# EAGLE design openmv (EAGLE 6.1)
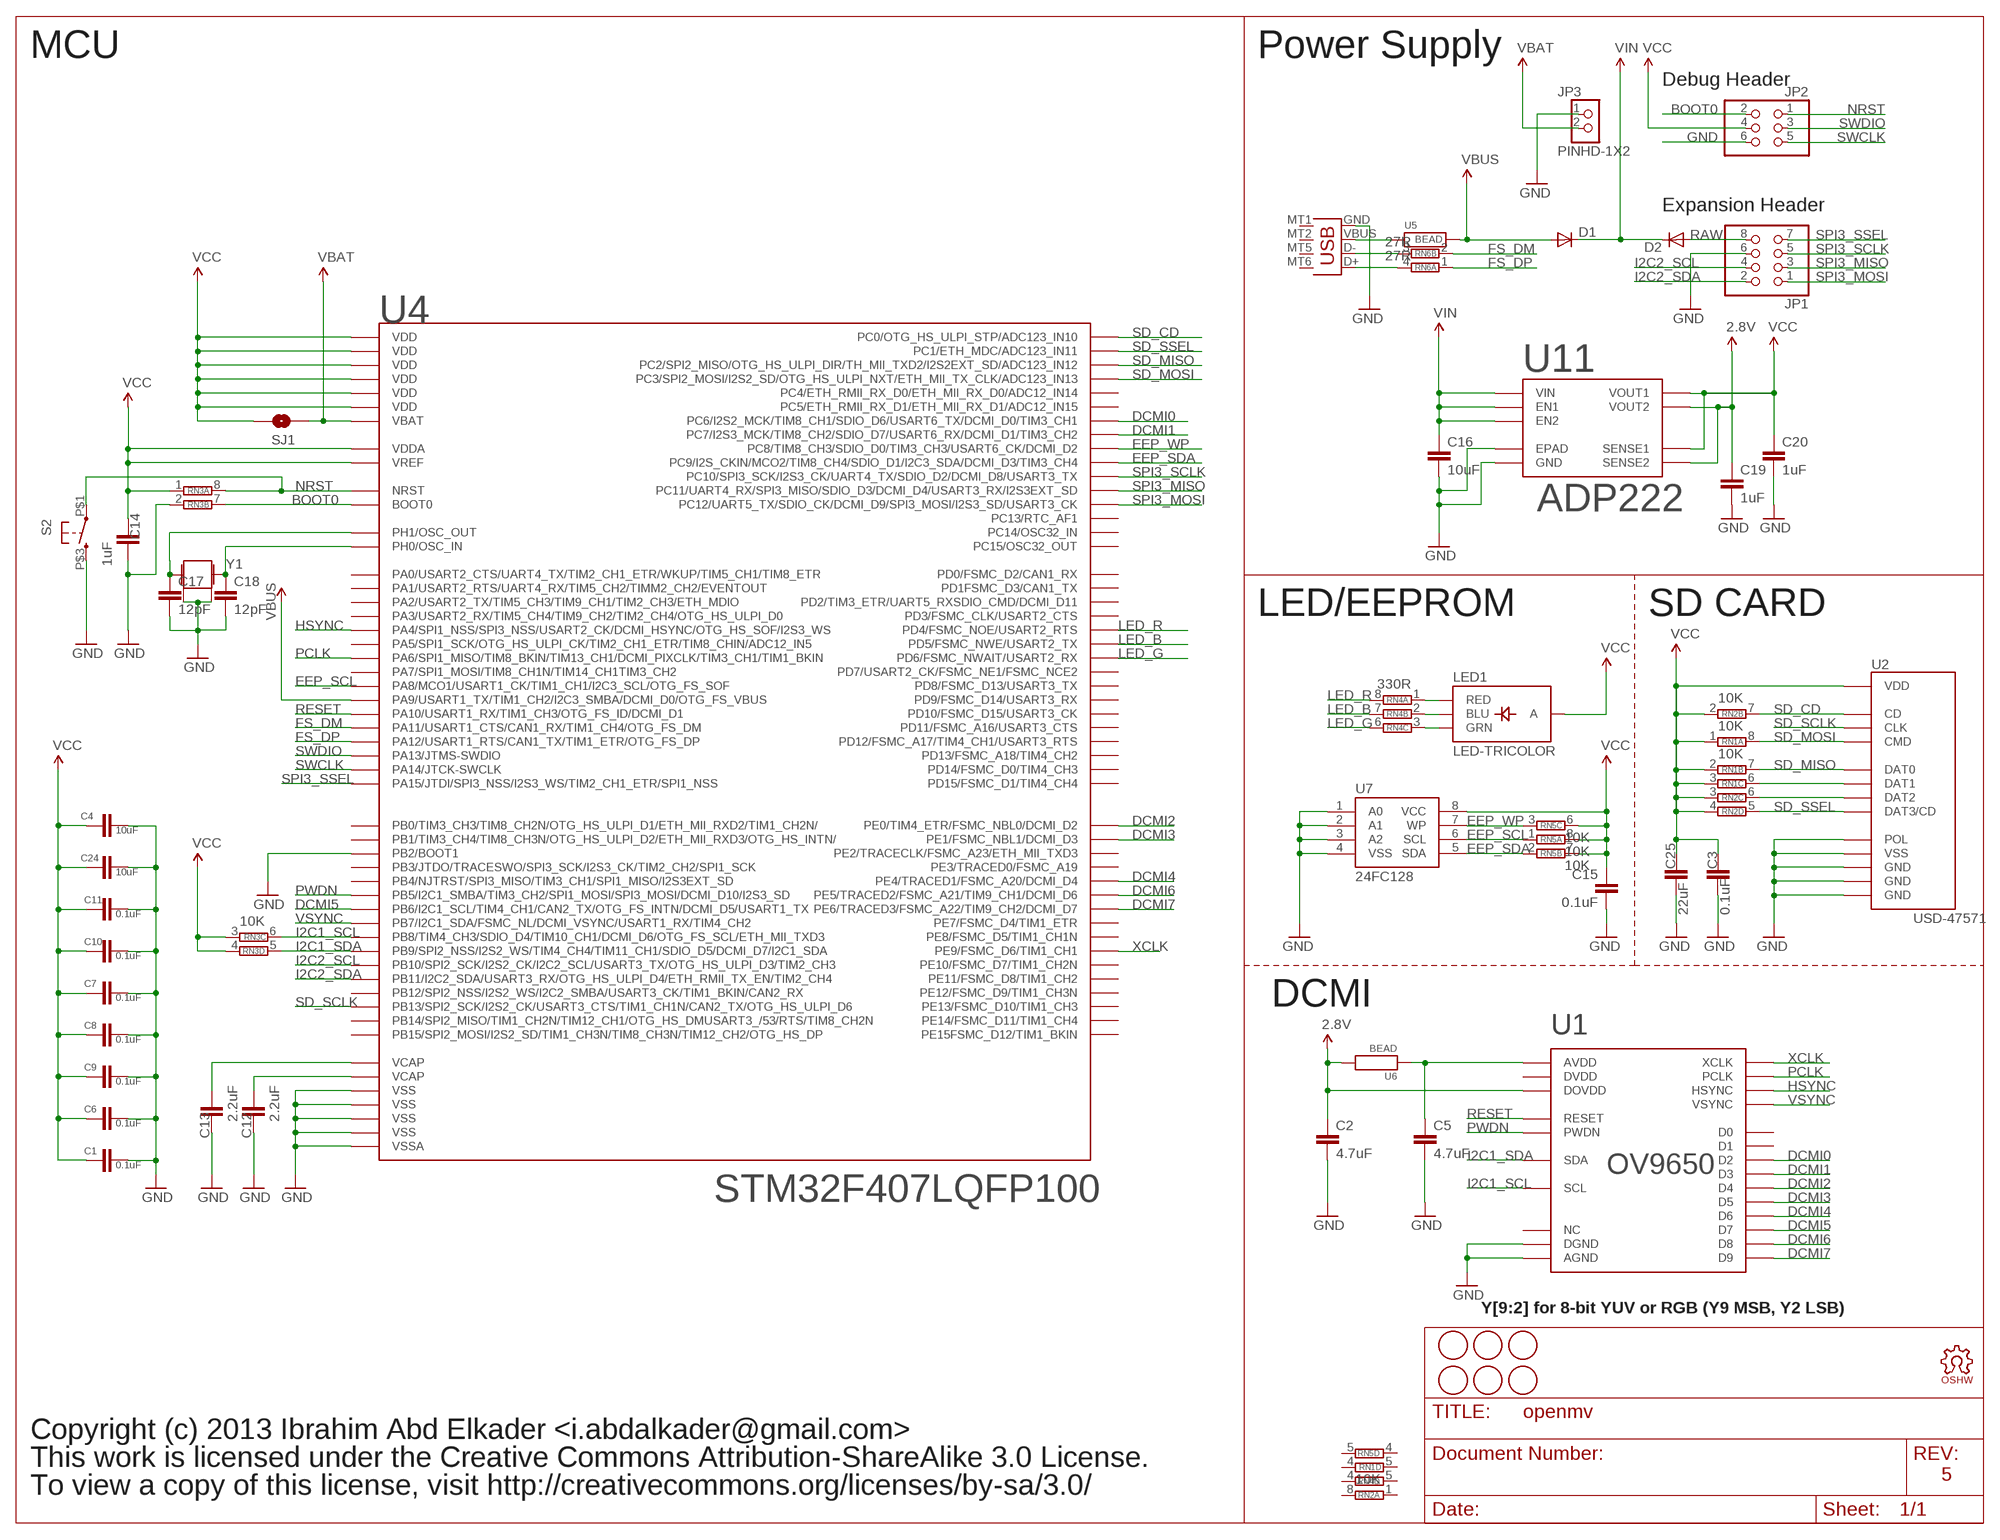
[diagram p0: schematic, sheet 1]

## Parts
C1  0.1uF  CAP0402-CAP  [0402-CAP]
C2  4.7uF  CAP0402-CAP  [0402-CAP]
C3  0.1uF  CAP0402-CAP  [0402-CAP]
C4  10uF  CAP0805  [0805]
C5  4.7uF  CAP0402-CAP  [0402-CAP]
C6  0.1uF  CAP0402-CAP  [0402-CAP]
C7  0.1uF  CAP0402-CAP  [0402-CAP]
C8  0.1uF  CAP0402-CAP  [0402-CAP]
C9  0.1uF  CAP0402-CAP  [0402-CAP]
C10  0.1uF  CAP0402-CAP  [0402-CAP]
C11  0.1uF  CAP0402-CAP  [0402-CAP]
C12  2.2uF  CAP0402-CAP  [0402-CAP]
C13  2.2uF  CAP0402-CAP  [0402-CAP]
C14  1uF  CAP0402-CAP  [0402-CAP]
C15  0.1uF  CAP0402-CAP  [0402-CAP]
C16  10uF  CAP0805  [0805]
C17  12pF  CAP0402-CAP  [0402-CAP]
C18  12pF  CAP0402-CAP  [0402-CAP]
C19  1uF  CAP0402-CAP  [0402-CAP]
C20  1uF  CAP0402-CAP  [0402-CAP]
C24  10uF  CAP0805  [0805]
C25  22uF  CAP0805  [0805]
D1  DIODESOD  [SOD-323]
D2  DIODESOD  [SOD-323]
JP1  PINHD-2X4  [2X04]
JP2  PINHD-2X3  [2X03]
JP3  PINHD-1X2  [1X2]
LED1  LED-TRICOLOR  [LED-TRICOLOR-SMD]
LOGO1  OSHW_LOGO_FILLX0150-NT  [OSHW_FILLX150_NOTEXT]
RN1  10K  4R-NCAT16  [CAT16]
RN2  10K  4R-NCAT16  [CAT16]
RN3  10K  4R-NCAT16  [CAT16]
RN4  330R  4R-NCAT16  [CAT16]
RN5  10K  4R-NCAT16  [CAT16]
RN6  27R  2R-NEXBV4V  [EXBV4V]
S2  SWITCHKMR442G  [KMR442G]
SJ1  SOLDERJUMPERTRACE  [SJ_2S-TRACE]
U1  OV9650  [OV9650]
U2  USD-47571  [USD-47571]
U4  STM32F407LQFP100  [LQFP100]
U5  BEAD  [0402-CAP]
U6  BEAD  [0402-CAP]
U7  24FC128  [MSOP8]
U11  ADP222  [LFCSP8]
U$3  FIDUCIAL  [FIDUCIAL_1MM]
U$4  FIDUCIAL  [FIDUCIAL_1MM]
U$5  FIDUCIAL  [FIDUCIAL_1MM]
U$7  FIDUCIAL  [FIDUCIAL_1MM]
U$9  FIDUCIAL  [FIDUCIAL_1MM]
U$10  FIDUCIAL  [FIDUCIAL_1MM]
X1  USB-MICROB  [USB-MICROB]
Y1  CRYSTAL2.5X2.0  [CRYSTAL-2.5X2.0]

## Nets
2.8V: C2.1 C19.1 U1.P$11(DOVDD) U6.2 U11.4(SENSE2) U11.5(VOUT2)
BOOT0: JP2.2 RN3.7 U4.94(BOOT0)
DCMI0: U1.P$19(D2) U4.63(PC6/I2S2_MCK/TIM8_CH1/SDIO_D6/USART6_TX/DCMI_D0/TIM3_CH1)
DCMI1: U1.P$21(D3) U4.64(PC7/I2S3_MCK/TIM8_CH2/SDIO_D7/USART6_RX/DCMI_D1/TIM3_CH2)
DCMI2: U1.P$22(D4) U4.97(PE0/TIM4_ETR/FSMC_NBL0/DCMI_D2)
DCMI3: U1.P$20(D5) U4.98(PE1/FSMC_NBL1/DCMI_D3)
DCMI4: U1.P$18(D6) U4.3(PE4/TRACED1/FSMC_A20/DCMI_D4)
DCMI5: U1.P$16(D7) U4.92(PB6/I2C1_SCL/TIM4_CH1/CAN2_TX/OTG_FS_INTN/DCMI_D5/USART1_TX)
DCMI6: U1.P$14(D8) U4.4(PE5/TRACED2/FSMC_A21/TIM9_CH1/DCMI_D6)
DCMI7: U1.P$12(D9) U4.5(PE6/TRACED3/FSMC_A22/TIM9_CH2/DCMI_D7)
EEP_SCL: RN5.1 U4.67(PA8/MCO1/USART1_CK/TIM1_CH1/I2C3_SCL/OTG_FS_SOF) U7.6(SCL)
EEP_SDA: RN5.2 U4.66(PC9/I2S_CKIN/MCO2/TIM8_CH4/SDIO_D1/I2C3_SDA/DCMI_D3/TIM3_CH4) U7.5(SDA)
EEP_WP: RN5.3 U4.65(PC8/TIM8_CH3/SDIO_D0/TIM3_CH3/USART6_CK/DCMI_D2) U7.7(WP)
FS_DM: RN6.2 U4.70(PA11/USART1_CTS/CAN1_RX/TIM1_CH4/OTG_FS_DM)
FS_DP: RN6.1 U4.71(PA12/USART1_RTS/CAN1_TX/TIM1_ETR/OTG_FS_DP)
GND: C1.1 C2.2 C3.2 C4.1 C5.2 C6.1 C7.2 C8.1 C9.1 C10.2 C11.2 C12.2 C13.2 C14.1 C15.2 C16.2 C17.2 C18.2 C19.2 C20.2 C24.1 C25.2 JP1.6 JP2.6 JP3.1 RN3.2 S2.P$3 U1.P$2(AGND) U1.P$15(DGND) U2.G$1(GND) U2.G$2(GND) U2.G$3(GND) U2.G$4(POL) U2.P$6(VSS) U4.10(VSS) U4.20(VSSA) U4.27(VSS) U4.37(PB2/BOOT1) U4.74(VSS) U4.99(VSS) U7.1(A0) U7.2(A1) U7.3(A2) U7.4(VSS) U11.3(GND) U11.EXP(EPAD) X1.GND Y1.2 Y1.4
HSYNC: U1.P$9(HSYNC) U4.29(PA4/SPI1_NSS/SPI3_NSS/USART2_CK/DCMI_HSYNC/OTG_HS_SOF/I2S3_WS)
I2C1_SCL: RN3.6 U1.P$5(SCL) U4.95(PB8/TIM4_CH3/SDIO_D4/TIM10_CH1/DCMI_D6/OTG_FS_SCL/ETH_MII_TXD3)
I2C1_SDA: RN3.5 U1.P$3(SDA) U4.96(PB9/SPI2_NSS/I2S2_WS/TIM4_CH4/TIM11_CH1/SDIO_D5/DCMI_D7/I2C1_SDA)
I2C2_SCL: JP1.4 U4.47(PB10/SPI2_SCK/I2S2_CK/I2C2_SCL/USART3_TX/OTG_HS_ULPI_D3/TIM2_CH3)
I2C2_SDA: JP1.2 U4.48(PB11/I2C2_SDA/USART3_RX/OTG_HS_ULPI_D4/ETH_RMII_TX_EN/TIM2_CH4)
LED_B: RN4.7 U4.86(PD5/FSMC_NWE/USART2_TX)
LED_G: RN4.6 U4.87(PD6/FSMC_NWAIT/USART2_RX)
LED_R: RN4.8 U4.85(PD4/FSMC_NOE/USART2_RTS)
N$1: RN1.6 U2.P$8(DAT1)
N$2: RN2.6 U2.P$1(DAT2)
N$3: LED1.R(RED) RN4.1
N$4: LED1.G(GRN) RN4.3
N$5: LED1.B(BLU) RN4.2
N$6: C17.1 U4.13(PH1/OSC_OUT) Y1.3
N$7: RN6.3 X1.D-
N$8: C18.1 U4.12(PH0/OSC_IN) Y1.1
N$10: C5.1 U1.P$4(AVDD) U6.1
N$14: RN6.4 X1.D+
N$22: U5.1 X1.VBUS
NRST: JP2.1 RN3.8 S2.P$1 U4.14(NRST)
PCLK: U1.P$17(PCLK) U4.31(PA6/SPI1_MISO/TIM8_BKIN/TIM13_CH1/DCMI_PIXCLK/TIM3_CH1/TIM1_BKIN)
PWDN: U1.P$8(PWDN) U4.91(PB5/I2C1_SMBA/TIM3_CH2/SPI1_MOSI/SPI3_MOSI/DCMI_D10/I2S3_SD)
RAW: D2.2(A) JP1.8
RESET: U1.P$6(RESET) U4.69(PA10/USART1_RX/TIM1_CH3/OTG_FS_ID/DCMI_D1)
SD_CD: RN2.7 U2.G$5(CD) U4.15(PC0/OTG_HS_ULPI_STP/ADC123_IN10)
SD_MISO: RN1.7 U2.P$7(DAT0) U4.17(PC2/SPI2_MISO/OTG_HS_ULPI_DIR/TH_MII_TXD2/I2S2EXT_SD/ADC123_IN12)
SD_MOSI: RN1.8 U2.P$3(CMD) U4.18(PC3/SPI2_MOSI/I2S2_SD/OTG_HS_ULPI_NXT/ETH_MII_TX_CLK/ADC123_IN13)
SD_SCLK: U2.P$5(CLK) U4.52(PB13/SPI2_SCK/I2S2_CK/USART3_CTS/TIM1_CH1N/CAN2_TX/OTG_HS_ULPI_D6)
SD_SSEL: RN2.5 U2.P$2(DAT3/CD) U4.16(PC1/ETH_MDC/ADC123_IN11)
SPI3_MISO: JP1.3 U4.79(PC11/UART4_RX/SPI3_MISO/SDIO_D3/DCMI_D4/USART3_RX/I2S3EXT_SD)
SPI3_MOSI: JP1.1 U4.80(PC12/UART5_TX/SDIO_CK/DCMI_D9/SPI3_MOSI/I2S3_SD/USART3_CK)
SPI3_SCLK: JP1.5 U4.78(PC10/SPI3_SCK/I2S3_CK/UART4_TX/SDIO_D2/DCMI_D8/USART3_TX)
SPI3_SSEL: JP1.7 U4.77(PA15/JTDI/SPI3_NSS/I2S3_WS/TIM2_CH1_ETR/SPI1_NSS)
SWCLK: JP2.5 U4.76(PA14/JTCK-SWCLK)
SWDIO: JP2.3 U4.72(PA13/JTMS-SWDIO)
VBAT: JP3.2 SJ1.1 U4.6(VBAT)
VBUS: D1.2(A) U4.68(PA9/USART1_TX/TIM1_CH2/I2C3_SMBA/DCMI_D0/OTG_FS_VBUS) U5.2
VCAP1: C13.1 U4.49(VCAP)
VCAP2: C12.1 U4.73(VCAP)
VCC: C1.2 C3.1 C4.2 C6.2 C7.1 C8.2 C9.2 C10.1 C11.1 C14.2 C15.1 C20.1 C24.2 C25.1 JP2.4 LED1.A RN1.1 RN1.2 RN1.3 RN2.2 RN2.3 RN2.4 RN3.1 RN3.3 RN3.4 RN5.6 RN5.7 RN5.8 SJ1.2 U2.P$4(VDD) U4.11(VDD) U4.19(VDD) U4.21(VREF) U4.22(VDDA) U4.28(VDD) U4.50(VDD) U4.75(VDD) U4.100(VDD) U7.8(VCC) U11.7(VOUT1) U11.8(SENSE1)
VIN: C16.1 D1.1(C) D2.1(C) U11.1(EN1) U11.2(EN2) U11.6(VIN)
VSYNC: U1.P$7(VSYNC) U4.93(PB7/I2C1_SDA/FSMC_NL/DCMI_VSYNC/USART1_RX/TIM4_CH2)
XCLK: U1.P$13(XCLK) U4.40(PE9/FSMC_D6/TIM1_CH1)
Unconnected: RN1.4 RN1.5 RN2.1 RN2.8 RN4.4 RN4.5 RN5.4 RN5.5 U1.P$1(NC) U1.P$10(DVDD) U1.P$23(D1) U1.P$24(D0) U4.1(PE2/TRACECLK/FSMC_A23/ETH_MII_TXD3) U4.2(PE3/TRACED0/FSMC_A19) U4.7(PC13/RTC_AF1) U4.8(PC14/OSC32_IN) U4.9(PC15/OSC32_OUT) U4.23(PA0/USART2_CTS/UART4_TX/TIM2_CH1_ETR/WKUP/TIM5_CH1/TIM8_ETR) U4.24(PA1/USART2_RTS/UART4_RX/TIM5_CH2/TIMM2_CH2/EVENTOUT) U4.25(PA2/USART2_TX/TIM5_CH3/TIM9_CH1/TIM2_CH3/ETH_MDIO) U4.26(PA3/USART2_RX/TIM5_CH4/TIM9_CH2/TIM2_CH4/OTG_HS_ULPI_D0) U4.30(PA5/SPI1_SCK/OTG_HS_ULPI_CK/TIM2_CH1_ETR/TIM8_CHIN/ADC12_IN5) U4.32(PA7/SPI1_MOSI/TIM8_CH1N/TIM14_CH1TIM3_CH2) U4.33(PC4/ETH_RMII_RX_D0/ETH_MII_RX_D0/ADC12_IN14) U4.34(PC5/ETH_RMII_RX_D1/ETH_MII_RX_D1/ADC12_IN15) U4.35(PB0/TIM3_CH3/TIM8_CH2N/OTG_HS_ULPI_D1/ETH_MII_RXD2/TIM1_CH2N/) U4.36(PB1/TIM3_CH4/TIM8_CH3N/OTG_HS_ULPI_D2/ETH_MII_RXD3/OTG_HS_INTN/) U4.38(PE7/FSMC_D4/TIM1_ETR) U4.39(PE8/FSMC_D5/TIM1_CH1N) U4.41(PE10/FSMC_D7/TIM1_CH2N) U4.42(PE11/FSMC_D8/TIM1_CH2) U4.43(PE12/FSMC_D9/TIM1_CH3N) U4.44(PE13/FSMC_D10/TIM1_CH3) U4.45(PE14/FSMC_D11/TIM1_CH4) U4.46(PE15FSMC_D12/TIM1_BKIN) U4.51(PB12/SPI2_NSS/I2S2_WS/I2C2_SMBA/USART3_CK/TIM1_BKIN/CAN2_RX) U4.53(PB14/SPI2_MISO/TIM1_CH2N/TIM12_CH1/OTG_HS_DMUSART3_/53/RTS/TIM8_CH2N) U4.54(PB15/SPI2_MOSI/I2S2_SD/TIM1_CH3N/TIM8_CH3N/TIM12_CH2/OTG_HS_DP) U4.55(PD8/FSMC_D13/USART3_TX) U4.56(PD9/FSMC_D14/USART3_RX) U4.57(PD10/FSMC_D15/USART3_CK) U4.58(PD11/FSMC_A16/USART3_CTS) U4.59(PD12/FSMC_A17/TIM4_CH1/USART3_RTS) U4.60(PD13/FSMC_A18/TIM4_CH2) U4.61(PD14/FSMC_D0/TIM4_CH3) U4.62(PD15/FSMC_D1/TIM4_CH4) U4.81(PD0/FSMC_D2/CAN1_RX) U4.82(PD1FSMC_D3/CAN1_TX) U4.83(PD2/TIM3_ETR/UART5_RXSDIO_CMD/DCMI_D11) U4.84(PD3/FSMC_CLK/USART2_CTS) U4.88(PD7/USART2_CK/FSMC_NE1/FSMC_NCE2) U4.89(PB3/JTDO/TRACESWO/SPI3_SCK/I2S3_CK/TIM2_CH2/SPI1_SCK) U4.90(PB4/NJTRST/SPI3_MISO/TIM3_CH1/SPI1_MISO/I2S3EXT_SD) X1.MT1(GND1) X1.MT2(GND2) X1.MT5(GND3) X1.MT6(GND4)

## Notes on the sheet
- MCU | Power Supply
- Debug Header
- Expansion Header
- LED/EEPROM | SD CARD
- DCMI
- Y[9:2] for 8-bit YUV or RGB (Y9 MSB, Y2 LSB)
- Copyright (c) 2013 Ibrahim Abd Elkader <i.abdalkader@gmail.com>
- This work is licensed under the Creative Commons Attribution-ShareAlike 3.0 License.
- 5
- To view a copy of this license, visit http://creativecommons.org/licenses/by-sa/3.0/

## Library data of the parts
C1-C20 C24 C25 = sfe:CAP: Capacitor Standard 0603 ceramic capacitor, and 0.1" leaded capacitor.
D1 D2 = sfe:DIODE: Diode These are standard reverse protection diodes and small signal diodes. SMA package can handle up to about 1A. SOD-323 can handle about 200mA. What the SOD-323 package when ordering, there are some mfgs out there that are 5-pin packages.
JP1 = pinhead:PINHD-2X4: PIN HEADER
JP2 = mux:PINHD-2X3: PIN HEADER
JP3 = mux:PINHD-1X2
LED1 = sfe:LED-TRICOLOR: Tri-Color LED SMD Proven layout and schematic for triple color LED in SMD package - common anode. Spark Fun Electronics SKU : COM-07844
LOGO1 = iofault:OSHW_LOGO_FILL
RN1-RN5 = resistor-dil:4R-N: Array Chip Resistor Source: RS Component / Phycomp; OC_FARNELL: unknown; OC_NEWARK: unknown
RN6 = resistor-dil:2R-N: Array Chip Resistor Source: Panasonic; OC_FARNELL: unknown; OC_NEWARK: unknown
S2 = mux:SWITCH
SJ1 = sfe:SOLDERJUMPER: Solder Jumper Standard SMD solder jumper. Used to automate production. Two varients : Normally Open and Normally Closed are the same, but have different paste layers. NC will have a large amount of paste and should jumper during reflow.
U1 = iofault:OV9650
U2 = mux:USD-47571
U4 = mux:STM32F407
U5 U6 = heka:BEAD
U7 = mux:24FC128
U11 = mux:ADP222
U$3-U$5 U$7 U$9 U$10 = adafruit:FIDUCIAL: For use by pick and place machines to calibrate the vision/machine, 1mm By microbuilder.eu
X1 = sfe:USB: USB Connectors USB-B-PTH is fully proven SKU : PRT-00139 USB-miniB is fully proven SKU : PRT-00587 USB-A-PCB is untested. USB-A-H is throughly reviewed, but untested. Spark Fun Electronics SKU : PRT-00437 USB-B-SMT is throughly reviewed, but untested. Needs silkscreen touching up. USB-A-S has not been used/tested USB-MB-H has not been used/tested
Y1 = mux:CRYSTAL: Crystals Various standard crystals. Proven footprints. Spark Fun Electronics SKU : COM-00534

## Net classes
0 default: width 0.152 mm

## Board
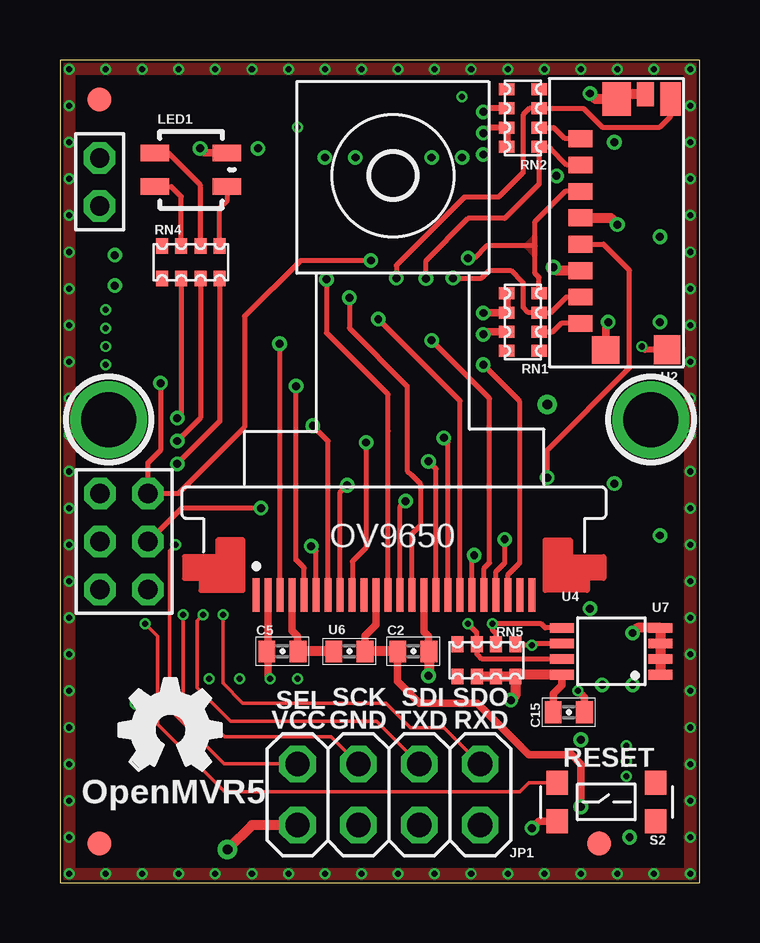
[diagram p1: board, top side]
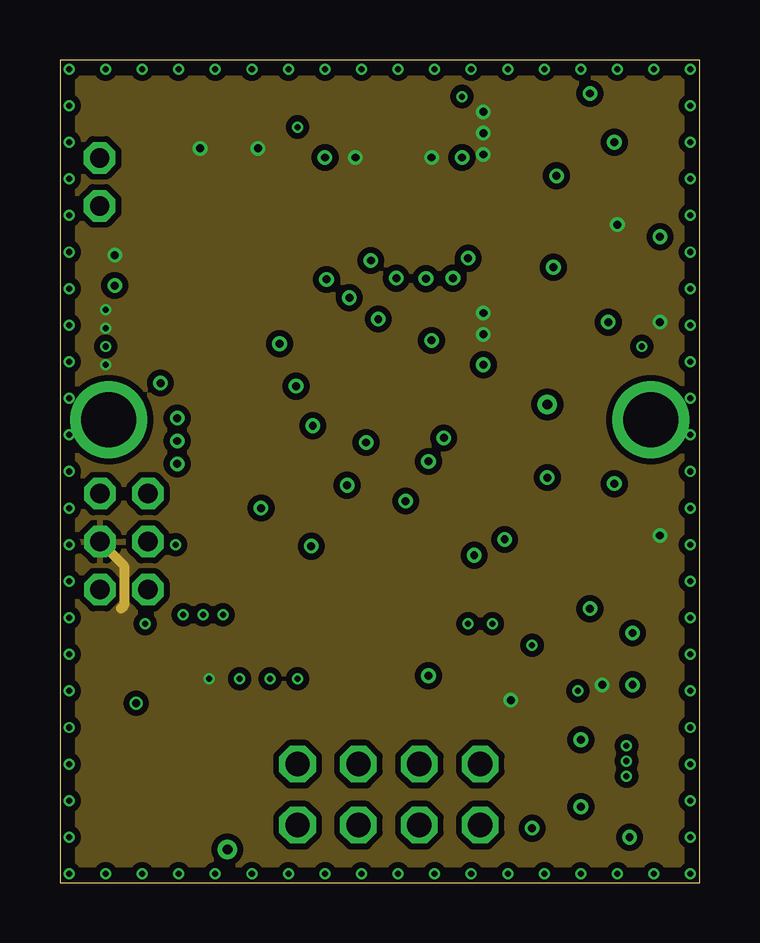
[diagram p2: board, inner layer Route2]
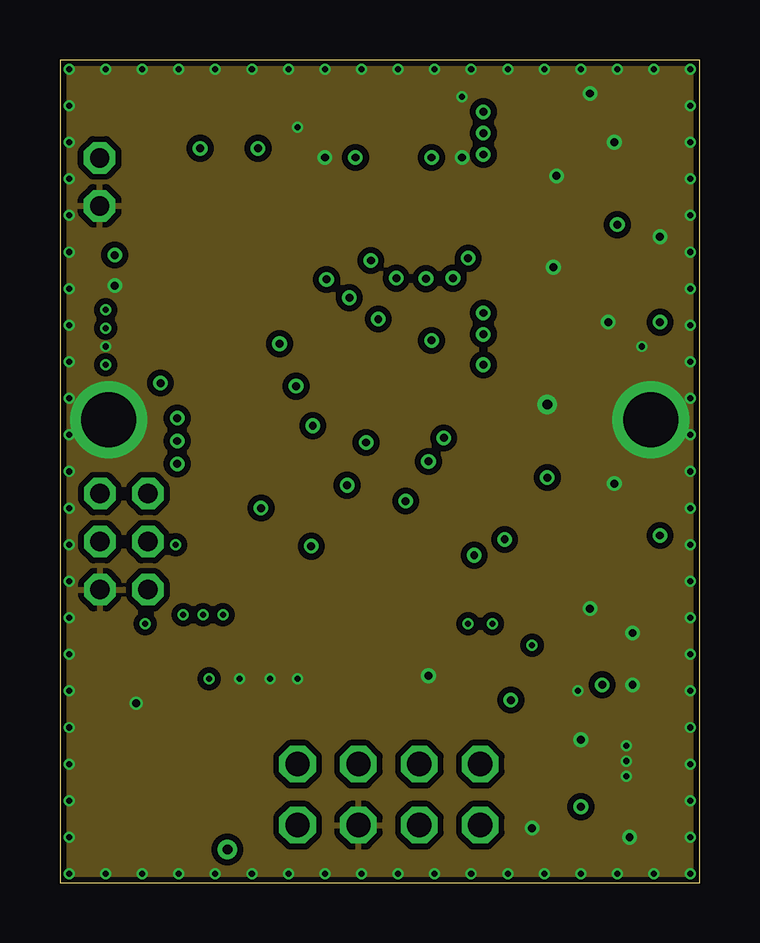
[diagram p3: board, inner layer Route15]
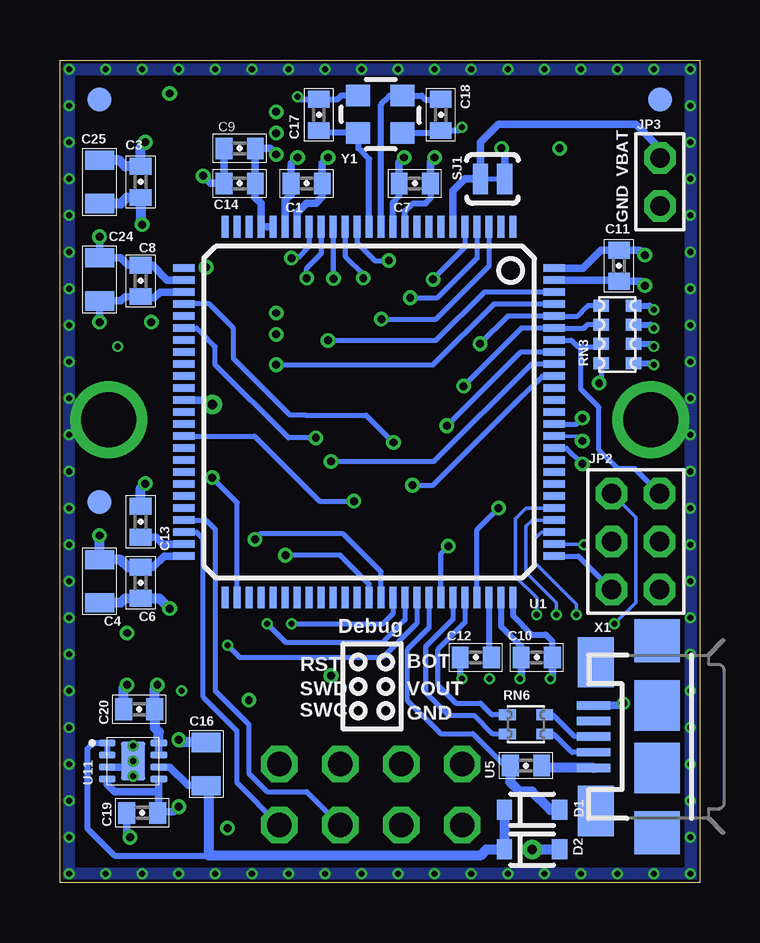
[diagram p4: board, bottom side, seen from below]

Size 26.67 x 34.29 mm. Coordinates in mm from the lower left corner, seen from the top.
Outline: 0,0 26.67,0 26.67,34.29 0,34.29 0,0
Copper layers (1*2+15*16): Top 0.035mm / dielectric 1.5mm / Route2 0.035mm / dielectric 0.15mm / Route15 0.035mm / dielectric 0.2mm / Bottom 0.035mm
Design rules: minimum track width 6mil, minimum drill 10mil, track to track 6mil, track to pad 6mil, pad to pad 6mil, via to via 6mil, smd to smd 6mil, copper to edge 5mil, drill to drill 13mil, minimum pad ring 10mil, minimum via ring 4mil, stop-mask expansion 2mil, vias tented up to drill 20mil, thermal gap 10mil

### Footprints (pad centres in the part's own frame; a part is rotated, then mirrored left to right if it is on the bottom)
0402-CAP = smd 0.7 x 0.9: 1 -0.65,0; 2 0.65,0
0805 = smd 0.8 x 1.2: 1 -0.9,0; 2 0.9,0
SOD-323 = smd 0.63 x 0.83: 1 -1.15,0; 2 1.15,0
2X04 = drill 1.016 octagon: 1 -3.81,-1.27; 2 -3.81,1.27; 3 -1.27,-1.27; 4 -1.27,1.27; 5 1.27,-1.27; 6 1.27,1.27; 7 3.81,-1.27; 8 3.81,1.27
2X03 = drill 0.8 octagon: 1 -2,-1; 2 -2,1; 3 0,-1; 4 0,1; 5 2,-1; 6 2,1
1X2 = drill 0.8 octagon: 1 1,0; 2 -1,0
LED-TRICOLOR-SMD = smd 0.7 x 1.2: A 0.7,-1.5; B 0.7,1.5; G -0.7,1.5; R -0.7,-1.5
CAT16 = smd 0.5 x 0.65: 1 -1.2,-0.675; 2 -0.4,-0.675; 3 0.4,-0.675; 4 1.2,-0.675; 5 1.2,0.675; 6 0.4,0.675; 7 -0.4,0.675; 8 -1.2,0.675
EXBV4V = smd 0.45 x 0.7: 1 -0.4,-0.775; 2 0.4,-0.775; 3 0.4,0.775; 4 -0.4,0.775
KMR442G = smd 0.9 x 1: P$1 -2,0.75; P$2 2.1,0.75; P$3 -2,-0.85; P$4 2.1,-0.85
SJ_2S-TRACE = smd 0.635 x 1.27: 1 -0.508,0; 2 0.508,0
OV9650 = smd 0.3 x 1.4: P$1 -5.6,-11.5; P$2 -5.1,-11.5; P$3 -4.6,-11.5; P$4 -4.1,-11.5; P$5 -3.6,-11.5; P$6 -3.1,-11.5; P$7 -2.6,-11.5; P$8 -2.1,-11.5; P$9 -1.6,-11.5; P$10 -1.1,-11.5; P$11 -0.6,-11.5; P$12 -0.1,-11.5; P$13 0.4,-11.5; P$14 0.9,-11.5; P$15 1.4,-11.5; P$16 1.9,-11.5; P$17 2.4,-11.5; P$18 2.9,-11.5; P$19 3.4,-11.5; P$20 3.9,-11.5; P$21 4.4,-11.5; P$22 4.9,-11.5; P$23 5.4,-11.5; P$24 5.9,-11.5
USD-47571 = smd 1.15 x 1.15: G$1 -4.9,0.55 | smd 1.2 x 1.1: G$2 -4.9,-2 | smd 1.4 x 1.2: G$3 5.55,0.1 | smd 1 x 0.7: G$4 5.75,-1.1 | smd 1.4 x 0.85: G$5 5.55,-2.15 | smd 0.7 x 1: P$1 3.9,1.6; P$2 2.8,1.6; P$3 1.7,1.6; P$4 0.6,1.6; P$5 -0.5,1.6; P$6 -1.6,1.6; P$7 -2.7,1.6; P$8 -3.8,1.6
LQFP100 = smd 0.9 x 0.3: 1 -7.72,6; 2 -7.72,5.5; 3 -7.72,5; 4 -7.72,4.5; 5 -7.72,4; 6 -7.72,3.5; 7 -7.72,3; 8 -7.72,2.5; 9 -7.72,2; 10 -7.72,1.5; 11 -7.72,1; 12 -7.72,0.5; 13 -7.72,0; 14 -7.72,-0.5; 15 -7.72,-1; 16 -7.72,-1.5; 17 -7.72,-2; 18 -7.72,-2.5; 19 -7.72,-3; 20 -7.72,-3.5; 21 -7.72,-4; 22 -7.72,-4.5; 23 -7.72,-5; 24 -7.72,-5.5; 25 -7.72,-6; 51 7.72,-6; 52 7.72,-5.5; 53 7.72,-5; 54 7.72,-4.5; 55 7.72,-4; 56 7.72,-3.5; 57 7.72,-3; 58 7.72,-2.5; 59 7.72,-2; 60 7.72,-1.5; 61 7.72,-1; 62 7.72,-0.5; 63 7.72,0; 64 7.72,0.5; 65 7.72,1; 66 7.72,1.5; 67 7.72,2; 68 7.72,2.5; 69 7.72,3; 70 7.72,3.5; 71 7.72,4; 72 7.72,4.5; 73 7.72,5; 74 7.72,5.5; 75 7.72,6 | smd 0.3 x 0.9: 26 -6,-7.72; 27 -5.5,-7.72; 28 -5,-7.72; 29 -4.5,-7.72; 30 -4,-7.72; 31 -3.5,-7.72; 32 -3,-7.72; 33 -2.5,-7.72; 34 -2,-7.72; 35 -1.5,-7.72; 36 -1,-7.72; 37 -0.5,-7.72; 38 0,-7.72; 39 0.5,-7.72; 40 1,-7.72; 41 1.5,-7.72; 42 2,-7.72; 43 2.5,-7.72; 44 3,-7.72; 45 3.5,-7.72; 46 4,-7.72; 47 4.5,-7.72; 48 5,-7.72; 49 5.5,-7.72; 50 6,-7.72; 76 6,7.72; 77 5.5,7.72; 78 5,7.72; 79 4.5,7.72; 80 4,7.72; 81 3.5,7.72; 82 3,7.72; 83 2.5,7.72; 84 2,7.72; 85 1.5,7.72; 86 1,7.72; 87 0.5,7.72; 88 0,7.72; 89 -0.5,7.72; 90 -1,7.72; 91 -1.5,7.72; 92 -2,7.72; 93 -2.5,7.72; 94 -3,7.72; 95 -3.5,7.72; 96 -4,7.72; 97 -4.5,7.72; 98 -5,7.72; 99 -5.5,7.72; 100 -6,7.72
MSOP8 = smd 0.4 x 1: 1 -0.975,-2.05; 2 -0.325,-2.05; 3 0.325,-2.05; 4 0.975,-2.05; 5 0.975,2.05; 6 0.325,2.05; 7 -0.325,2.05; 8 -0.975,2.05
LFCSP8 = smd 0.7 x 0.3: 1 -1.075,0.75; 2 -1.075,0.25; 3 -1.075,-0.25; 4 -1.075,-0.75; 5 1.075,-0.75; 6 1.075,-0.25; 7 1.075,0.25; 8 1.075,0.75 | smd 1 x 1.6: EXP 0,0
FIDUCIAL_1MM = smd 1 x 1: 1 0,0
USB-MICROB = smd 0.35 x 1.4: D+ 0,2.65; D- -0.65,2.65; GND 1.3,2.65; ID 0.65,2.65; VBUS -1.3,2.65 | smd 1.8 x 1.9: MT1 -4,0; MT2 4,0 | smd 2.1 x 1.5: MT3 3.1,2.55; MT4 -3.1,2.55 | smd 2.1 x 1.9: MT5 -1.3,0; MT6 1.3,0
CRYSTAL-2.5X2.0 = smd 1 x 0.9: 1 -0.95,-0.8; 2 0.9,-0.8; 3 0.9,0.75; 4 -0.95,0.75

### Placement (x,y rotation side)
C1  16.38,29.15 0 bottom
C2  14.73,9.65 0 top
C3  23.3,29.21 90 bottom
C4  25.02,12.57 90 bottom
C5  9.27,9.65 180 top
C6  23.3,12.51 90 bottom
C7  11.87,29.15 0 bottom
C8  23.3,25.08 270 bottom
C9  1uF  [0402-CAP]  19.18,30.61 0 bottom
C10  6.79,9.4 180 bottom
C11  3.37,25.72 270 bottom
C12  9.33,9.4 180 bottom
C13  23.3,15.05 90 bottom
C14  19.18,29.15 0 bottom
C15  21.21,7.11 0 top
C16  20.57,4.95 90 bottom
C17  22pF  [0402-CAP]  15.88,32 90 bottom
C18  22pF  [0402-CAP]  10.79,32 270 bottom
C19  23.24,2.92 180 bottom
C20  23.37,7.24 180 bottom
C24  25.02,25.15 270 bottom
C25  25.02,29.21 90 bottom
D1  6.99,3.05 0 bottom
D2  6.99,1.4 0 bottom
JP1  13.72,3.68 180 top
JP2  2.67,14.22 270 bottom
JP3  1.65,29.21 270 bottom
LED1  5.46,29.72 90 top
LOGO1  2.48,4.7 0 top
RN1  19.3,23.37 270 top
RN2  19.3,31.88 270 top
RN3  3.43,22.86 90 bottom
RN4  5.46,25.87 180 top
RN5  17.78,9.27 180 top
RN6  7.24,6.6 270 bottom
S2  22.73,3.43 0 top
SJ1  8.64,29.34 0 bottom
U1  13.78,23.5 0 top
U2  23.3,27.11 90 top
U4  13.78,19.62 270 bottom
U5  7.24,4.89 180 bottom
U6  12.06,9.65 0 top
U7  22.99,9.65 90 top
U11  23.62,5.08 0 bottom
U$3  22.48,1.65 0 top
U$4  1.65,1.65 0 top
U$5  1.65,32.64 0 top
U$7  1.65,32.64 0 bottom
U$9  25.02,15.88 0 bottom
U$10  25.02,32.64 0 bottom
X1  1.78,6.1 90 bottom
Y1  13.34,32 180 bottom

### Tracks (layer width: path | path; a pad name or v marks a point on that pad's centre or on a via)
2.8V  (via drill 0.33 pad 0.61)
  Top 0.305: U1.P$11 13.18,10.77 12.71,10.3 U6.2 | C2.1 14.08,8.4 14.99,7.49 17.4,7.49 19.56,5.33 21.34,5.33 21.72,4.95 v21.72,3.17
  Top 0.406: C2.1 U6.2
  Bottom 0.305: U11.5 22.55,3.81 | 22.55,3.81 22.55,2.96 | 22.55,2.96 C19.1 | U11.4 24.7,4.12 24.38,3.81 22.55,3.81 | 22.55,2.96 21.93,2.96 v21.72,3.17
BOOT0
  Bottom 0.203: 4.95,22.35 5.08,22.35 5.35,22.62 U4.94 | 4.95,22.35 4.21,22.35 RN3.7 | 4.95,22.35 4.95,20.57 4.19,19.81 4.19,18.03 3.43,17.27 2.71,17.27 JP2.2
DCMI0  (via drill 0.33 pad 0.61)
  Top 0.203: U1.P$19 17.18,13.56 v17.27,13.65
  Bottom 0.203: U4.63 13.78,12.45 14.99,13.66 17.28,13.66 v17.27,13.65
DCMI1  (via drill 0.33 pad 0.61)
  Top 0.203: U1.P$21 18.18,12.97 18.54,13.34 v18.54,14.31
  Bottom 0.203: U4.64 13.28,12.96 14.86,14.54 18.32,14.54 v18.54,14.31
DCMI2  (via drill 0.33 pad 0.61)
  Top 0.203: U1.P$22 18.68,12.84 19.18,13.34 19.18,20.07 v17.65,21.59
  Bottom 0.203: v17.65,21.59 11.11,21.59 8.58,24.12 U4.97
DCMI3  (via drill 0.33 pad 0.61)
  Top 0.203: U1.P$20 17.68,13.11 17.91,13.34 17.91,20.19 v15.49,22.61
  Bottom 0.203: v15.49,22.61 10.99,22.61 8.97,24.62 U4.98
DCMI4  (via drill 0.33 pad 0.61)
  Top 0.203: U1.P$18 16.68,20.09 v13.27,23.5
  Bottom 0.203: v13.27,23.5 10.99,23.5 8.78,25.7 U4.3
DCMI5  (via drill 0.33 pad 0.61)
  Top 0.203: v15.37,17.56 15.68,17.25 U1.P$16
  Bottom 0.203: v15.37,17.56 11.08,17.56 7.02,21.62 U4.92
DCMI6  (via drill 0.33 pad 0.61)
  Top 0.203: U1.P$14 14.68,14.55 15.05,14.92 15.05,16.61 14.68,16.98 14.48,17.18 14.48,20.7 12.06,23.11 v12.06,24.38
  Bottom 0.203: v12.06,24.38 10.92,24.38 9.28,26.03 U4.4
DCMI7  (via drill 0.33 pad 0.61)
  Top 0.203: v11.11,25.15 11.11,22.92 13.59,20.45 13.68,20.36 13.68,18.83 U1.P$12
  Bottom 0.203: U4.5 9.78,26.48 v11.11,25.15
EEP_SCL  (via drill 0.25 pad 0.41)
  Top 0.203: U7.6 19.76,9.98 v19.68,9.91 19.02,9.91 RN5.1
  Bottom 0.203: v19.68,9.91 19.18,9.4 13.21,9.4 11.78,10.83 U4.67
EEP_SDA  (via drill 0.25 pad 0.41)
  Top 0.203: RN5.2 18.18,10.39 18.03,10.54 v18.03,10.79 20.07,10.79 20.23,10.63 U7.5
  Bottom 0.203: v18.03,10.79 17.27,10.03 13.21,10.03 12.28,10.96 U4.66
EEP_WP  (via drill 0.25 pad 0.41)
  Top 0.203: v17.02,10.79 17.38,10.43 RN5.3 17.38,9.54 17.4,9.53 17.6,9.33 U7.7
  Bottom 0.203: v17.02,10.79 13.21,10.79 12.78,11.22 U4.65
FS_DM
  Bottom 0.203: U4.70 10.28,10.99 11.43,9.84 11.43,7.94 10.48,6.99 9.4,6.99 8.62,6.2 RN6.2
FS_DP
  Bottom 0.203: U4.71 9.78,10.86 10.92,9.72 10.92,8.26 10.16,7.49 9.14,7.49 8.65,7 RN6.1
GND  (via drill 0.25, 0.25 pad 0.41, 0.33 pad 0.41, 0.33 pad 0.61, 0.41 pad 0.81, 2.29 pad 0.81, 2.29 pad 1.68)
  Top 0.254: U2.G$2 24.39,22.21 v24.26,22.35
  Top 0.305: U1.P$15 15.18,10.47 15.37,10.29 15.37,9.67 C2.2 | U2.G$1 22.75,23.26 v22.86,23.37 | S2.P$3 19.98,2.58 v19.68,2.29 | C15.2 21.86,7.73 v21.59,8 | 8.68,9.71 8.68,8.59 v8.76,8.51 | U1.P$2 8.68,9.71 | 8.68,9.71 C5.2
  Top 0.406: U2.P$6 20.71,25.52 v20.57,25.65 | U2.G$4 23.4,32.86 U2.G$3 22.33,32.66 v22.1,32.89 | C2.2 15.38,8.65 v15.37,8.64 | U7.1 U7.2 U7.3 U7.4 24.09,10.63 v23.88,10.41
  Bottom 0.254: U4.74 8.28,10.69 7.43,9.84 7.43,9.41 | RN3.2 2.01,22.46 v1.91,22.35 | U4.10 12.28,27.98 11.94,28.32 11.43,28.32 11.22,28.53 C7.2 | Y1.2 14.95,32.8 15.11,32.64 15.86,32.64 | 15.86,32.64 16.64,32.64 v16.76,32.77 | 15.86,32.64 C17.2 | Y1.4 10.89,31.25 C18.2 10.05,31.35 v9.91,31.5 | C12.2 9.98,8.59 v9.91,8.51
  Bottom 0.305: U4.37 20.5,20.12 v20.32,19.94 | C10.2 7.43,9.41 7.43,8.57 v7.49,8.51 | C7.2 11.22,30.05 v11.05,30.23 | U11.3 23.87,4.83 U11.EXP | C19.2 23.89,2.05 v23.75,1.91 | C9.1 C14.1 20.38,29.15 v20.7,29.46 | U4.20 17.28,28.44 17.02,28.7 17.03,28.72 C1.1 17.03,29.96 v16.76,30.23 | v25.02,26.92 C24.1 24.14,26.05 23.83,25.73 C8.1 22.81,25.73 22.2,25.12 U4.27 | U4.99 3.42,25.12 C11.2 2.46,25.07 v2.29,24.89 | X1.GND 3.27,7.4 v3.17,7.49
  Bottom 0.406: C25.2 24.19,30.11 23.94,29.86 C3.2 23.3,30.67 v23.11,30.86 | C4.1 25.01,11.68 24.13,11.68 23.95,11.86 C6.1 22.53,11.86 v22.1,11.43 | C13.2 23.3,16.45 v23.11,16.64 | C16.2 21.6,5.85 v21.72,5.97 | C20.2 24.02,8.11 v23.88,8.26
  other vias: 2.03,19.3 24.64,19.3 23.62,5.71 23.62,5.08 23.62,4.45 0.38,33.91 1.91,33.91 3.43,33.91 4.95,33.91 6.48,33.91 8,33.91 9.53,33.91 11.05,33.91 12.57,33.91 14.1,33.91 15.62,33.91 17.14,33.91 18.67,33.91 20.19,33.91 21.72,33.91 23.24,33.91 24.77,33.91 26.29,33.91 26.29,8 26.29,9.53 26.29,11.05 26.29,12.57 26.29,14.1 26.29,15.62 26.29,17.14 26.29,18.67 26.29,20.19 26.29,21.72 26.29,23.24 26.29,24.77 26.29,26.29 26.29,27.81 26.29,29.34 26.29,30.86 26.29,32.38 0.38,32.38 0.38,30.86 0.38,29.34 0.38,27.81 0.38,26.29 0.38,24.77 0.38,23.24 0.38,21.72 0.38,20.19 0.38,18.67 0.38,17.14 0.38,15.62 0.38,14.1 0.38,12.57 0.38,11.05 0.38,9.53 0.38,8 0.38,6.48 0.38,4.95 0.38,3.43 0.38,1.91 0.38,0.38 1.91,0.38 3.43,0.38 4.95,0.38 6.48,0.38 8,0.38 9.53,0.38 11.05,0.38 12.57,0.38 14.1,0.38 15.62,0.38 17.14,0.38 18.67,0.38 20.19,0.38 21.72,0.38 23.24,0.38 24.77,0.38 26.29,0.38 26.29,6.48 26.29,4.95 26.29,3.43 26.29,1.91
  pour Route15 (isolate 0.254): 0,0 0,34.29 26.67,34.29 26.67,0
  pour Bottom: 0,0.51 26.16,0.51 26.16,33.78 0.51,33.78 0.51,0.64 0,0.64 0,34.29 26.67,34.29 26.67,0 0,0
  pour Top: 0,0.51 26.16,0.51 26.16,33.78 0.51,33.78 0.51,0.64 0,0.64 0,34.29 26.67,34.29 26.67,0 0,0
HSYNC  (via drill 0.33 pad 0.61)
  Top 0.203: v12.76,18.35 12.76,13.97 12.19,13.4 12.19,12.01 U1.P$9
  Bottom 0.203: v12.76,18.35 13.91,19.49 16.45,19.49 17.08,19.49 19.43,21.84 19.43,23.11 20.45,24.13 U4.29
I2C1_SCL  (via drill 0.33 pad 0.61)
  Top 0.203: U1.P$5 10.18,13.12 9.84,13.46 v9.84,20.7
  Bottom 0.203: v9.84,20.7 7.42,23.12 U4.95 4.82,23.12 4.7,23.24 4.68,23.26 RN3.6
I2C1_SDA  (via drill 0.33 pad 0.61)
  Top 0.203: U1.P$3 9.18,22.44 v9.16,22.47
  Bottom 0.203: v9.16,22.47 8,23.62 U4.96 5.08,23.62 4.7,24 4.64,24.06 RN3.5
I2C2_SCL
  Bottom 0.203: U4.47 20.58,15.12 20.19,14.73 20.19,8 18.8,6.6 18.8,4.57 18.03,3.81 16.38,3.81 JP1.4
I2C2_SDA
  Bottom 0.203: U4.48 20.97,14.62 20.7,14.35 20.7,7.75 19.3,6.35 19.3,4.19 JP1.2
LED_B  (via drill 0.33 pad 0.61)
  Top 0.203: RN4.7 5.86,19.39 v4.89,18.41
  Bottom 0.152: U4.86 5.1,18.62 v4.89,18.41
LED_G  (via drill 0.33 pad 0.61)
  Top 0.203: RN4.6 5.06,19.54 v4.89,19.37
  Bottom 0.203: U4.87 5.14,19.12 v4.89,19.37
LED_R  (via drill 0.33 pad 0.61)
  Top 0.203: RN4.8 6.66,19.23 v4.89,17.46
  Bottom 0.203: U4.85 5.55,18.12 v4.89,17.46
N$1
  Top 0.203: U2.P$8 20.9,23.31 20.57,22.99 20.55,22.97 RN1.6
N$2
  Top 0.203: U2.P$1 21.05,31.02 20.59,31.48 RN2.6
N$3
  Top 0.203: RN4.1 6.66,28.12 6.96,28.42 LED1.R
N$4
  Top 0.203: RN4.3 5.06,28.59 4.64,29.02 LED1.G
N$5
  Top 0.203: RN4.2 5.86,29.06 4.51,30.42 LED1.B
N$6
  Bottom 0.254: U4.13 13.78,30.16 14.22,30.61 14.23,30.62 Y1.3 15.78,31.25 C17.1
N$7
  Bottom 0.203: X1.D- 5.32,5.45 5.97,6.1 6.08,6.2 RN6.3
N$8
  Bottom 0.254: U4.12 13.28,32.44 12.95,32.77 12.92,32.8 Y1.1 11.6,32.8 11.43,32.64 10.81,32.64 C18.1
N$10
  Top 0.305: U1.P$4 9.68,10.51 9.91,10.29 9.91,9.67 C5.1
  Top 0.406: U6.1 C5.1
N$14
  Bottom 0.203: X1.D+ 5.21,6.1 5.97,6.86 6.12,7 RN6.4
N$22
  Bottom 0.406: X1.VBUS 6.5,4.8 U5.1
NRST  (via drill 0.25 pad 0.41, 0.33 pad 0.61)
  Top 0.152: v3.56,10.79 4.06,10.29 4.06,6.6 6.86,3.81 19.18,3.81 19.55,4.18 S2.P$1
  Top 0.203: v12.96,25.93 10.03,25.93 7.69,23.6 7.69,19 4.92,16.22 JP2.1 3.67,17.51 4.19,18.03 v4.19,20.83
  Bottom 0.152: JP2.1 3.65,16.22 2.67,15.24 2.67,11.68 v3.56,10.79
  Bottom 0.203: U4.14 14.28,26.68 13.54,25.93 v12.96,25.93 | RN3.8 4.1,20.91 v4.19,20.83
PCLK  (via drill 0.33 pad 0.61)
  Top 0.203: U1.P$17 16.18,18.36 v16,18.54
  Bottom 0.203: v16,18.54 16.32,18.54 17.14,18.54 20.19,21.59 20.19,22.35 20.83,22.99 20.96,23.12 U4.31
PWDN  (via drill 0.33 pad 0.61)
  Top 0.203: U1.P$8 11.68,16.28 v11.97,16.57
  Bottom 0.203: v11.97,16.57 11.11,16.57 7.37,20.32 6.56,21.12 U4.91
RAW  (via drill 0.41 pad 0.81)
  Top 0.406: JP1.8 8,2.41 v6.99,1.4
  Bottom 0.406: v6.99,1.4 D2.2
RESET  (via drill 0.33 pad 0.61)
  Top 0.203: U1.P$6 10.68,13.83 v10.48,14.03
  Bottom 0.203: U4.69 10.78,13.73 v10.48,14.03
SD_CD  (via drill 0.33 pad 0.61)
  Top 0.203: v14.02,25.2 14.02,25.73 16.86,28.57 18.29,28.57 19.3,29.59 19.3,32 19.58,32.28 RN2.7 21.82,32.28 22.61,31.5 25.02,31.5 25.45,31.93 U2.G$5
  Bottom 0.203: U4.15 14.78,26.11 14.02,25.35 v14.02,25.2
SD_MISO  (via drill 0.33 pad 0.61)
  Top 0.203: v16.38,25.2 17.58,25.2 17.91,25.53 18.8,25.53 19.3,25.02 19.3,24 19.54,23.77 RN1.7 20.47,23.77 21.11,24.41 U2.P$7
  Bottom 0.203: U4.17 15.78,26.22 16.38,25.61 v16.38,25.2
SD_MOSI  (via drill 0.33 pad 0.61)
  Top 0.203: 19.81,26.54 17.78,26.54 17.27,26.04 v17.02,26.04 | 19.81,26.54 19.81,27.56 21.07,28.81 U2.P$3 | RN1.8 19.98,25.23 19.81,25.4 19.81,26.54
  Bottom 0.203: U4.18 16.28,26.52 16.76,26.04 v17.02,26.04
  pour Top: 19.81,26.92 19.81,26.16 19.43,26.54
SD_SCLK  (via drill 0.33 pad 0.61)
  Top 0.203: U2.P$5 22.66,26.61 23.75,25.53 23.75,21.46 20.32,18.03 v20.32,16.89
  Bottom 0.203: U4.52 19.28,15.85 v20.32,16.89
SD_SSEL  (via drill 0.33 pad 0.61)
  Top 0.203: v15.26,25.18 15.26,25.93 17.02,27.69 18.54,27.69 19.98,29.12 RN2.5 20.38,30.68 20.45,30.61 21.14,29.91 U2.P$2
  Bottom 0.203: U4.16 15.28,25.2 v15.26,25.18
SPI3_MISO  (via drill 0.25 pad 0.41)
  Top 0.152: JP1.3 13.21,6.73 7.11,6.73 5.71,8.13 5.71,10.92 v5.97,11.18
  Bottom 0.152: U4.79 6.98,15.12 7.24,14.86 7.24,12.95 5.97,11.68 v5.97,11.18
SPI3_MOSI  (via drill 0.25 pad 0.41)
  Top 0.152: v6.79,11.18 6.79,8.32 7.62,7.49 13.59,7.49 14.61,6.48 16,6.48 JP1.1
  Bottom 0.152: U4.80 7.24,15.62 7.68,15.18 7.68,12.76 6.79,11.87 v6.79,11.18
SPI3_SCLK  (via drill 0.25 pad 0.41)
  Top 0.152: v5.14,11.18 5.14,7.81 6.86,6.1 11.3,6.1 JP1.5
  Bottom 0.152: U4.78 6.59,14.62 6.86,14.35 6.86,13.34 5.14,11.62 v5.14,11.18
SPI3_SSEL  (via drill 0.25 pad 0.41)
  Top 0.152: JP1.7 9.89,4.97 6.84,4.97 4.57,7.24 4.57,11.43 4.57,13.84 v4.83,14.1
  Bottom 0.152: U4.77 4.85,14.12 v4.83,14.1
SWCLK
  Bottom 0.203: U4.76 5.06,13.62 JP2.5
SWDIO  (via drill 0.33 pad 0.61)
  Top 0.203: v8.38,15.62 5.19,15.62 5.06,15.62 JP2.3
  Bottom 0.203: U4.72 9.28,14.72 v8.38,15.62
VBAT
  Bottom 0.305: U4.6 10.28,28.84 9.78,29.34 SJ1.1 9.14,30.86 8.38,31.62 2.67,31.62 1.65,30.61 JP3.2
VBUS
  Bottom 0.203: U4.68 11.28,10.63 12.19,9.72 12.19,7.62 10.79,6.22 9.46,6.22 8.13,4.89 U5.2
  Bottom 0.406: D1.2 6.22,3.05 6.99,3.81 7.49,3.81 7.89,4.21 U5.2
VCAP1
  Bottom 0.305: U4.49 22.38,14.12 22.67,14.41 23.29,14.41 C13.1
VCAP2
  Bottom 0.254: U4.73 8.78,9.49
  Bottom 0.305: 8.78,9.49 C12.1
VCC  (via drill 0.25 pad 0.41, 0.33 pad 0.61)
  Top 0.254: RN2.2 17.8,32.28 v17.65,32.13 | RN2.3 17.89,31.48 v17.65,31.24
  Top 0.305: v17.65,23.75 17.67,23.77 RN1.2 RN1.1 | RN1.3 17.76,22.97 v17.65,22.86 | U7.8 20.94,8.24 20.57,7.87 20.57,7.13 C15.1 | RN2.4 RN2.3 | LED1.A 6.03,30.42 v5.84,30.61
  Top 0.406: RN5.8 RN5.7 RN5.6 | RN5.8 18.98,7.8 v18.8,7.62 | U7.8 19.06,8.68 RN5.8 | U2.P$4 22.96,27.71 v23.24,27.43
  Route2 0.406: JP2.4 1.67,14.21 2.67,13.21 2.67,11.56 2.54,11.43
  Bottom 0.254: U4.75 7.78,11.14 6.99,10.35 6.41,10.35 6.14,10.08 C10.1 | RN3.4 2.09,24.06 v1.91,23.88 | RN3.3 2.05,23.26 v1.91,23.11 | U4.11 12.78,28.37 12.52,28.62 C7.1 | RN3.1 1.98,21.66 v1.91,21.59
  Bottom 0.305: U4.50 22.32,13.62 22.8,13.14 23.29,13.14 C6.2 | U11.8 U11.7 | C7.1 12.52,30.02 v12.32,30.23 | v17.65,30.35 17.91,30.61 C9.2 C14.2 18.53,28.56 18.28,28.31 U4.22 U4.21 | U4.19 16.78,27.92 16.38,28.32 16,28.32 15.73,28.59 C1.2 15.73,29.99 v15.49,30.23 | v25.02,23.37 C24.2 25.01,24.26 24.13,24.26 23.95,24.43 C8.2 23.26,24.38 22.73,24.38 22.5,24.62 U4.28 | U4.100 4.86,25.62 4.11,26.37 C11.1 2.49,26.37 v2.29,26.16 | C10.1 6.14,8.59 v6.22,8.51 | SJ1.2 8.13,30.48 v8.26,30.61
  Bottom 0.406: C25.1 24.13,28.31 23.88,28.56 C3.1 23.3,27.5 v23.24,27.43 | 23.29,13.14 23.81,13.14 24.13,13.46 25.01,13.46 C4.2 v25.02,14.48 | U11.8 22.55,6.29 22.72,6.46 C20.1 22.72,8.14 v22.61,8.26
  pour Route2 (isolate 0.254): 0.76,0.76 0.76,33.53 25.91,33.53 25.91,0.76
VIN
  Bottom 0.254: U11.2 U11.1 25.29,5.83 25.53,5.59 25.53,2.29 24.38,1.14 20.46,1.14
  Bottom 0.305: U11.6 22.1,4.83 21.34,4.06 20.59,4.06 C16.1
  Bottom 0.406: C16.1 20.46,3.94 20.46,1.14 9.14,1.14 8.89,1.4 D2.1 D1.1
VSYNC  (via drill 0.33 pad 0.61)
  Top 0.203: U1.P$7 11.18,18.41 v10.54,19.05
  Bottom 0.203: v10.54,19.05 7.47,22.12 U4.93
XCLK  (via drill 0.33 pad 0.61)
  Top 0.203: U1.P$13 14.18,15.68 v14.41,15.91
  Bottom 0.203: U4.40 18.56,18.62 15.85,15.91 v14.41,15.91

### Text on the board
tPlace: SEL | SCK | SDI | SDO | VCC | GND | TXD | RXD | RESET | OpenMV | R5
bPlace: VBAT | GND | Debug | BOT | RST | VOUT | SWD | GND | SWC